# Altium schematic sheet 0A - Blockschema.SchDoc
size A4; SchemaTitle: Title?
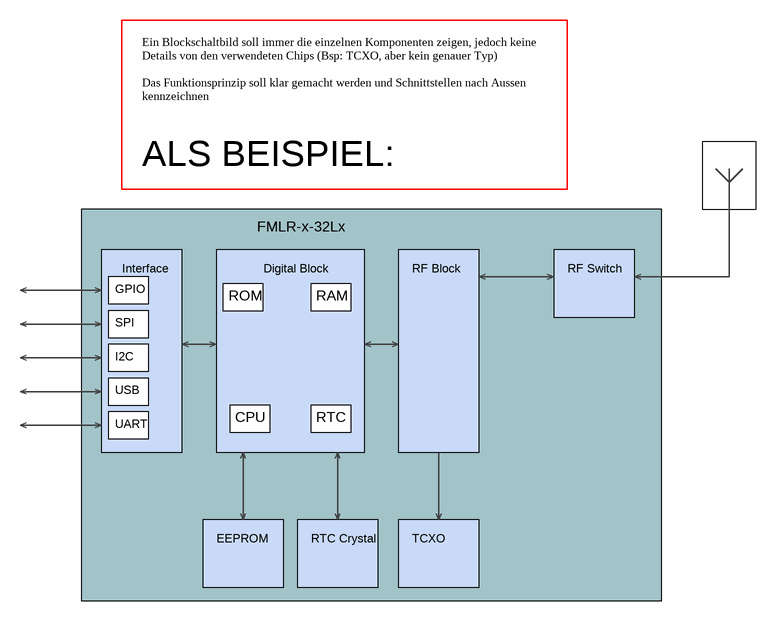
[diagram p0: 0A - Blockschema.SchDoc]

## Notes on the sheet
- Ein Blockschaltbild soll immer die einzelnen Komponenten zeigen, jedoch keine Details von den verwendeten Chips (Bsp: TCXO, aber kein genauer Typ)
  Das Funktionsprinzip soll klar gemacht werden und Schnittstellen nach Aussen kennzeichnen
- ALS BEISPIEL:
- FMLR-x-32Lx
- GPIO
- Interface
- ROM
- Digital Block
- RAM
- RF Block
- RF Switch
- SPI
- I2C
- USB
- UART
- CPU
- RTC
- EEPROM
- RTC Crystal
- TCXO
- Schema Title:
- PCB Name:
- Author:
- Co-Author:
- Customer:
- Variant:
- Project:
- Revision:
- Reviewer:
- Checked by:
- Date:
- Time:
- Sheet:
- of